# EAGLE schematic SubConn Interface Card (EAGLE 5.12)
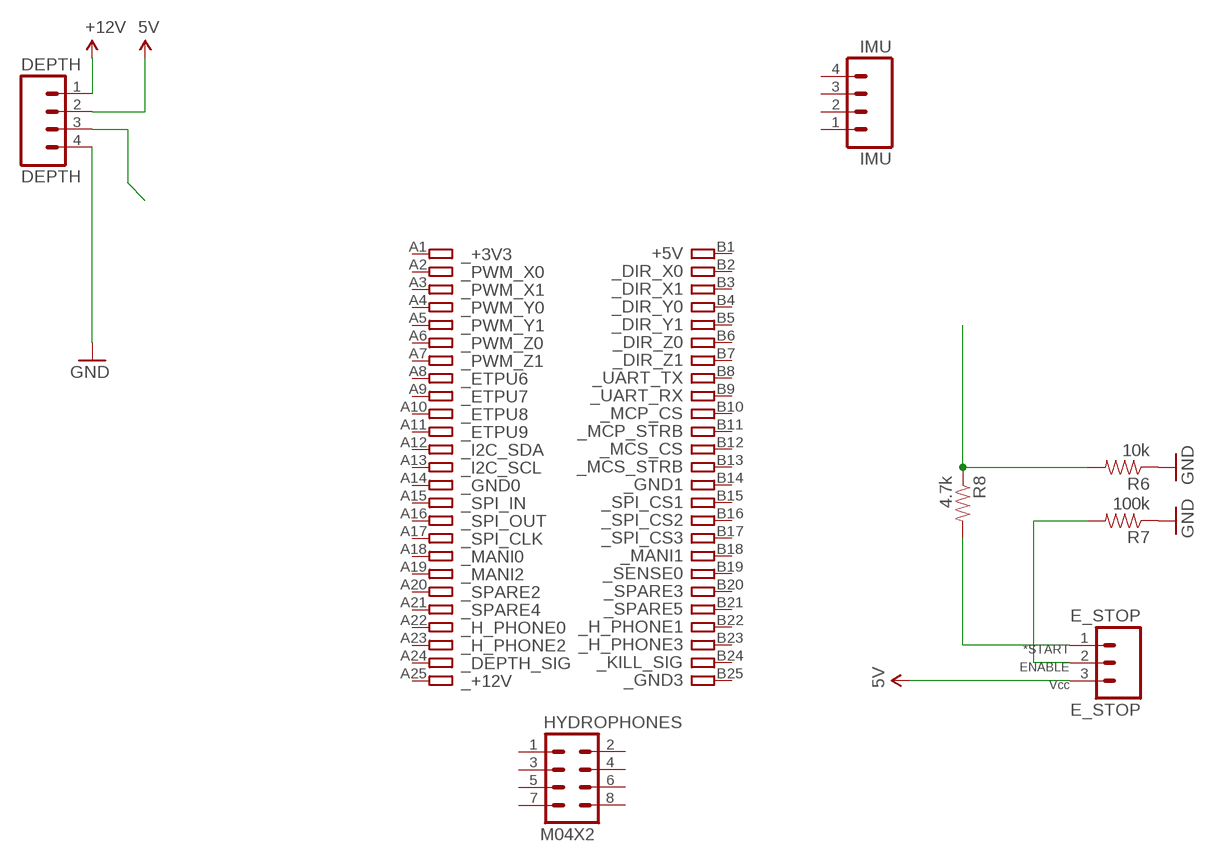
[diagram p0: schematic, sheet 1]

## Parts
DEPTH  DEPTH  M04POLAR  [MOLEX-1X4]
E_STOP  E_STOP  M03POLAR  [MOLEX-1X3]
HYDROPHONES  M04X2  [2X4]
IMU  IMU  M04POLAR  [MOLEX-1X4]
R6  10k  RESISTOR1206  [1206]
R7  100k  RESISTOR1206  [1206]
R8  4.7k  RESISTOR1206  [1206]
U$1  CARD_50PIN  [CARD_50PIN]

## Nets
5V: DEPTH.2 E_STOP.3
12V: DEPTH.1 ; supply symbol labelled +12V
GND: DEPTH.4 R6.1 R7.1
N$2: R6.2 R8.1
N$11: E_STOP.2 R7.2
N$15: DEPTH.3
N$43: E_STOP.1 R8.2
Unconnected: HYDROPHONES.1 HYDROPHONES.2 HYDROPHONES.3 HYDROPHONES.4 HYDROPHONES.5 HYDROPHONES.6 HYDROPHONES.7 HYDROPHONES.8 IMU.1 IMU.2 IMU.3 IMU.4 U$1.A1 U$1.A2 U$1.A3 U$1.A4 U$1.A5 U$1.A6 U$1.A7 U$1.A8 U$1.A9 U$1.A10 U$1.A11 U$1.A12 U$1.A13 U$1.A14 U$1.A15 U$1.A16 U$1.A17 U$1.A18 U$1.A19 U$1.A20 U$1.A21 U$1.A22 U$1.A23 U$1.A24 U$1.A25 U$1.B1 U$1.B2 U$1.B3 U$1.B4 U$1.B5 U$1.B6 U$1.B7 U$1.B8 U$1.B9 U$1.B10 U$1.B11 U$1.B12 U$1.B13 U$1.B14 U$1.B15 U$1.B16 U$1.B17 U$1.B18 U$1.B19 U$1.B20 U$1.B21 U$1.B22 U$1.B23 U$1.B24 U$1.B25

## Notes on the sheet
- *START
- ENABLE
- Vcc

## Library data of the parts
DEPTH IMU = SparkFun:M04: Header 4 Standard 4-pin 0.1" header. Use with straight break away headers (SKU : PRT-00116), right angle break away headers (PRT-00553), swiss pins (PRT-00743), machine pins (PRT-00117), and female headers (PRT-00115). Molex polarized connector foot print use with SKU : PRT-08231 with associated crimp pins and housings. 1MM SMD Version SKU: PRT-10208
E_STOP = SparkFun:M03: Header 3 Standard 3-pin 0.1" header. Use with straight break away headers (SKU : PRT-00116), right angle break away headers (PRT-00553), swiss pins (PRT-00743), machine pins (PRT-00117), and female headers (PRT-00115). Molex polarized connector foot print use with SKU : PRT-08232 with associated crimp pins and housings.
HYDROPHONES = SparkFun:M04X2
R6-R8 = SparkFun:RESISTOR: Resistor Basic schematic elements and footprints for 0603, 1206, and PTH 1/10th watt (small) resistors.
U$1 = ARVP:CARD_50PIN